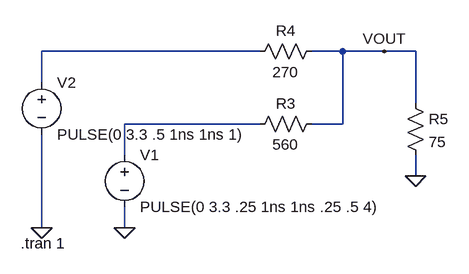
[diagram p0: schematic DAC_Sim.asc]
DAC_Sim.asc, the LTspice schematic file:
Version 4
SHEET 1 880 680
WIRE -64 -32 -400 -32
WIRE 64 -32 16 -32
WIRE 128 -32 64 -32
WIRE 176 -32 128 -32
WIRE -400 16 -400 -32
WIRE 176 48 176 -32
WIRE -64 80 -272 80
WIRE 64 80 64 -32
WIRE 64 80 16 80
WIRE -272 128 -272 80
WIRE 176 160 176 128
WIRE -400 240 -400 96
WIRE -272 240 -272 208
FLAG -272 240 0
FLAG -400 240 0
FLAG 176 160 0
FLAG 128 -32 VOUT
SYMBOL res 32 64 R90
WINDOW 0 0 56 VBottom 2
WINDOW 3 32 56 VTop 2
SYMATTR InstName R3
SYMATTR Value 560
SYMBOL res 32 -48 R90
WINDOW 0 0 56 VBottom 2
WINDOW 3 32 56 VTop 2
SYMATTR InstName R4
SYMATTR Value 270
SYMBOL voltage -272 112 R0
WINDOW 123 0 0 Left 0
WINDOW 39 0 0 Left 0
SYMATTR InstName V1
SYMATTR Value PULSE(0 3.3 .25 1ns 1ns .25 .5 4)
SYMBOL voltage -400 0 R0
WINDOW 123 0 0 Left 0
WINDOW 39 0 0 Left 0
SYMATTR InstName V2
SYMATTR Value PULSE(0 3.3 .5 1ns 1ns 1)
SYMBOL res 160 32 R0
SYMATTR InstName R5
SYMATTR Value 75
TEXT -432 264 Left 2 !.tran 1

The netlist it stands for:
* DAC_Sim.asc
R3 VOUT N002 560
R4 VOUT N001 270
V1 N002 0 PULSE(0 3.3 .25 1ns 1ns .25 .5 4)
V2 N001 0 PULSE(0 3.3 .5 1ns 1ns 1)
R5 VOUT 0 75
.tran 1
.backanno
.end